# Altium schematic sheet TK1000_Spolerigg.SchDoc
size A4
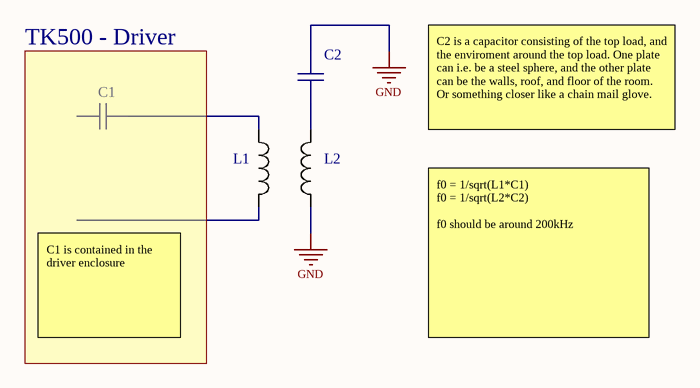
[diagram p0: TK1000_Spolerigg.SchDoc]

## Parts
C1  100nF  [CAPC0805(2012)100_N]  (value not drawn)
C2  100nF  [CAPC0805(2012)100_N]  (value not drawn)
L1  SMD spoler  [INDP3225X20N]  (value not drawn)
L2  SMD spoler  [INDP3225X20N]  (value not drawn)

## Blocks framed on the sheet
TK500 - Driver: C1

## Nets
GND: C2.2 L2.2
NetC1_2: C1.2 L1.1
NetC2_1: C2.1 L2.1

Not connected (* = marked no-connect by the designer): C1 1; L1 2

## Notes on the sheet
- C2 is a capacitor consisting of the top load, and the enviroment around the top load. One plate can i.e. be a steel sphere, and the other plate can be the walls, roof, and floor of the room. Or something closer like a chain mail glove.
- C1 is contained in the driver enclosure
- f0 = 1/sqrt(L1*C1)
  f0 = 1/sqrt(L2*C2)
  f0 should be around 200kHz

## Library data of the parts
C1 C2 = 2445: X7R 50V; id: 2445; pakke_opprettet_av: 815; leverandor_varenr: 2408556; pris: 1; nokkelord: Kondensator, capacitor; produsent: Multikomp; leverandor: Farnell; pakketype: 0805; pakke_opprettet: 14.11.2014 20:52:01; symbol_opprettet_av: 815; symbol_opprettet: 14.11.2014 20:19:34; navn: 100nF
L1 L2 = 1739: SMD inductors og tomme SMD bokser; id: 1739; pakke_opprettet_av: 924; pris: -1; pakke_opprettet: 26.05.2015 23:51:10; symbol_opprettet_av: 924; symbol_opprettet: 27.05.2015 00:20:21; navn: SMD spoler; pakketype: SMD